# Altium schematic sheet GPS_SATA.SchDoc: RNG RPI Interface
size 420 x 297 mm; Author: G.Kasprowicz; CompanyName: WUT ISE; DrawnBy: G.Kasprowicz; Organization: WUT ISE; Address1: PW ISE; Address2: Nowowiejska 15/19 00-665 Warsaw; Address3: gkasprow@gmail.com; Revision: 2; SheetNumber: -; SheetTotal: -; ModifiedBy: -; CheckedDate: -; Title2: GPS & SATA IO; DivGrp: WUT ISE; Designer: G.Kasprowicz; ModifiedDate: -; ProjectName: Sensor Box
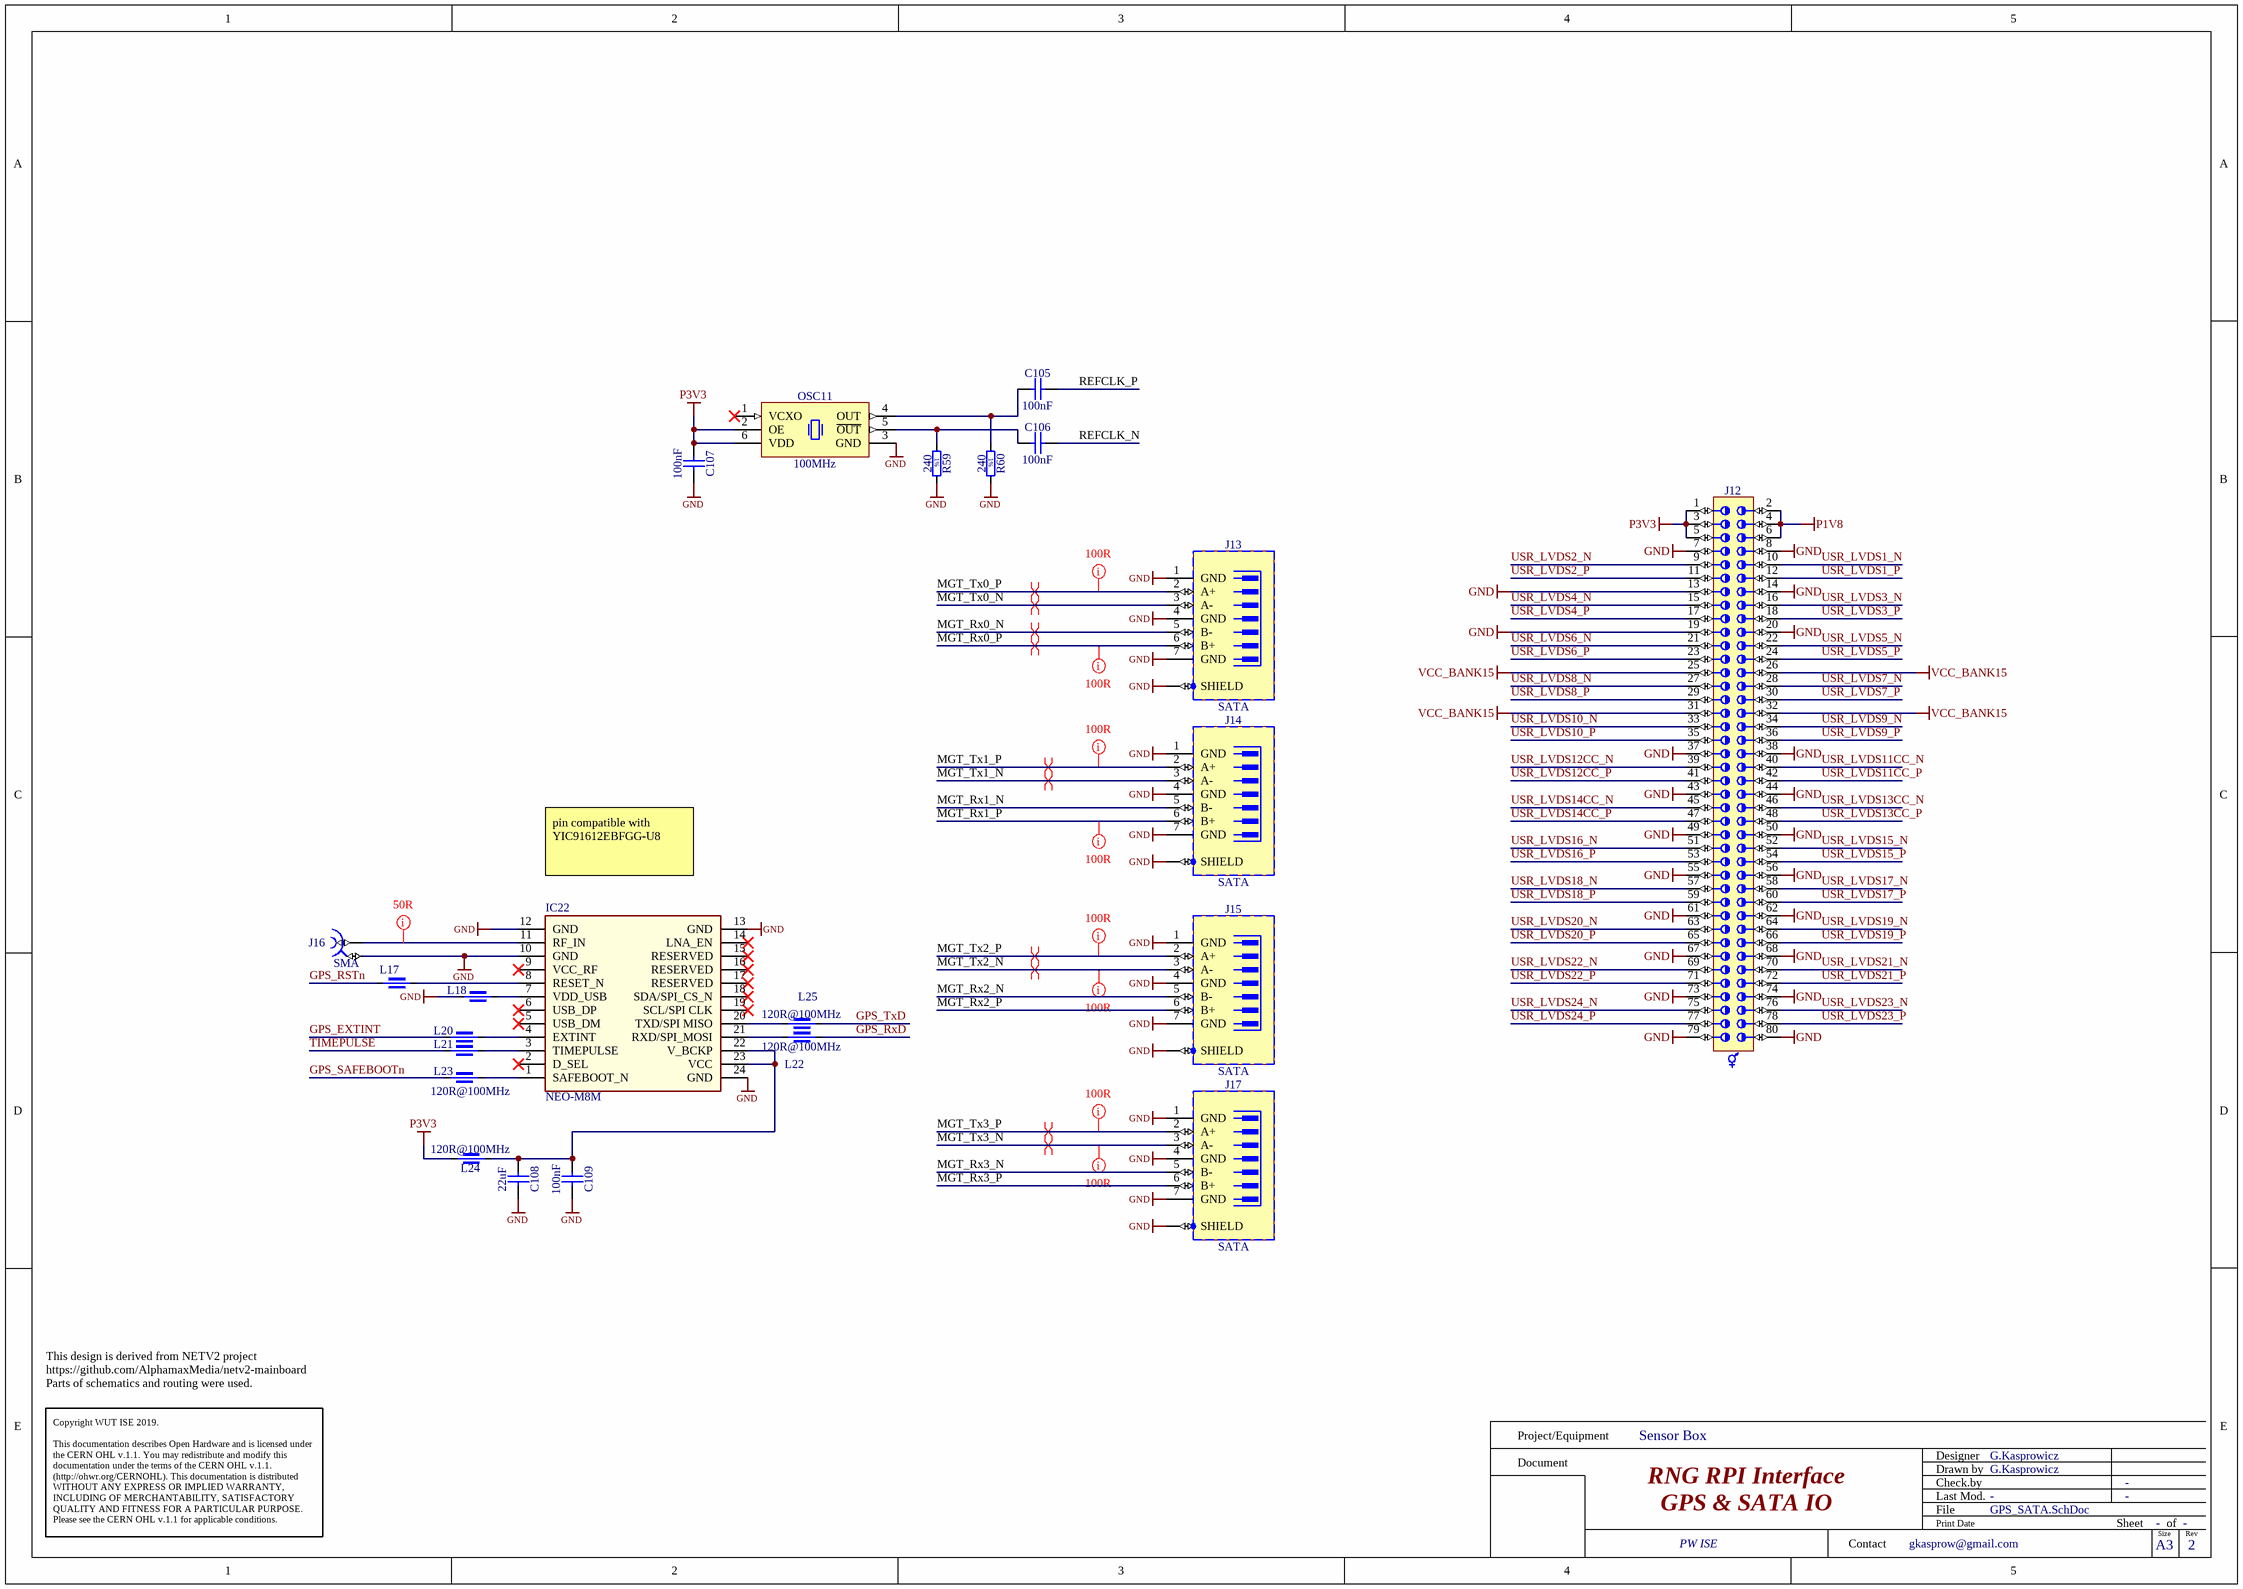
[diagram p0: GPS_SATA.SchDoc]

## Parts
C105  100nF  [CAPC0603X33N]
C106  100nF  [CAPC0603X33N]
C107  100nF  [CAPC0603X33N]
C108  22uF  [CAPC2012X135N]
C109  100nF  [CAPC0603X33N]
IC22  NEO-M8M  [NEO]
J12  (no value)  [SAMTEC_LSS-140-01-L-DV-A]
J13  SATA  [3M_5607-4200-SH]
J14  SATA  [3M_5607-4200-SH]
J15  SATA  [3M_5607-4200-SH]
J16  SMA  [MOLEX_73251-2120]
J17  SATA  [3M_5607-4200-SH]
L17  120R@100MHz  [INDC1608X65N]  (value not drawn)
L18  120R@100MHz  [INDC1608X65N]  (value not drawn)
L20  120R@100MHz  [INDC1608X65N]  (value not drawn)
L21  120R@100MHz  [INDC1608X65N]  (value not drawn)
L22  120R@100MHz  [INDC1608X65N]
L23  120R@100MHz  [INDC1608X65N]
L24  120R@100MHz  [INDC1608X65N]
L25  120R@100MHz  [INDC1608X65N]
OSC11  100MHz  [OSCSC254P500X700X190-6N]
R59  240  [RESC1005X40N]
R60  240  [RESC1005X40N]

## Nets
GND: C107.2 C108.2 C109.2 IC22.10(GND) IC22.12(GND) IC22.13(GND) IC22.24(GND) J12.7 J12.8 J12.13 J12.14 J12.19 J12.20 J12.37 J12.38 J12.43 J12.44 J12.49 J12.50 J12.55 J12.56 J12.61 J12.62 J12.67 J12.68 J12.73 J12.74 J12.79 J12.80 J13.1(GND) J13.4(GND) J13.7(GND) J13.8(SHIELD) J14.1(GND) J14.4(GND) J14.7(GND) J14.8(SHIELD) J15.1(GND) J15.4(GND) J15.7(GND) J15.8(SHIELD) J16.2 J17.1(GND) J17.4(GND) J17.7(GND) J17.8(SHIELD) L18.2 OSC11.3(GND) R59.2 R60.2
P1V8: J12.2 J12.4 J12.6
P3V3: C107.1 J12.1 J12.3 J12.5 L24.2 OSC11.2(OE) OSC11.6(VDD)
VCC_BANK15: J12.25 J12.26 J12.31 J12.32
GPS_EXTINT: L20.2
GPS_RSTn: L17.1
GPS_RxD: L22.2
GPS_SAFEBOOTn: L23.2
GPS_TxD: L25.1
MGT_Rx0_N: J13.5(B-)
MGT_Rx0_P: J13.6(B+)
MGT_Rx1_N: J14.5(B-)
MGT_Rx1_P: J14.6(B+)
MGT_Rx2_N: J15.5(B-)
MGT_Rx2_P: J15.6(B+)
MGT_Rx3_N: J17.5(B-)
MGT_Rx3_P: J17.6(B+)
MGT_Tx0_N: J13.3(A-)
MGT_Tx0_P: J13.2(A+)
MGT_Tx1_N: J14.3(A-)
MGT_Tx1_P: J14.2(A+)
MGT_Tx2_N: J15.3(A-)
MGT_Tx2_P: J15.2(A+)
MGT_Tx3_N: J17.3(A-)
MGT_Tx3_P: J17.2(A+)
REFCLK_N: C106.2
REFCLK_P: C105.2
TIMEPULSE: L21.2
USR_LVDS1_N: J12.10
USR_LVDS1_P: J12.12
USR_LVDS2_N: J12.9
USR_LVDS2_P: J12.11
USR_LVDS3_N: J12.16
USR_LVDS3_P: J12.18
USR_LVDS4_N: J12.15
USR_LVDS4_P: J12.17
USR_LVDS5_N: J12.22
USR_LVDS5_P: J12.24
USR_LVDS6_N: J12.21
USR_LVDS6_P: J12.23
USR_LVDS7_N: J12.28
USR_LVDS7_P: J12.30
USR_LVDS8_N: J12.27
USR_LVDS8_P: J12.29
USR_LVDS9_N: J12.34
USR_LVDS9_P: J12.36
USR_LVDS10_N: J12.33
USR_LVDS10_P: J12.35
USR_LVDS11CC_N: J12.40
USR_LVDS11CC_P: J12.42
USR_LVDS12CC_N: J12.39
USR_LVDS12CC_P: J12.41
USR_LVDS13CC_N: J12.46
USR_LVDS13CC_P: J12.48
USR_LVDS14CC_N: J12.45
USR_LVDS14CC_P: J12.47
USR_LVDS15_N: J12.52
USR_LVDS15_P: J12.54
USR_LVDS16_N: J12.51
USR_LVDS16_P: J12.53
USR_LVDS17_N: J12.58
USR_LVDS17_P: J12.60
USR_LVDS18_N: J12.57
USR_LVDS18_P: J12.59
USR_LVDS19_N: J12.64
USR_LVDS19_P: J12.66
USR_LVDS20_N: J12.63
USR_LVDS20_P: J12.65
USR_LVDS21_N: J12.70
USR_LVDS21_P: J12.72
USR_LVDS22_N: J12.69
USR_LVDS22_P: J12.71
USR_LVDS23_N: J12.76
USR_LVDS23_P: J12.78
USR_LVDS24_N: J12.75
USR_LVDS24_P: J12.77
NetC105_1: C105.1 OSC11.4(OUT) R60.1
NetC106_1: C106.1 OSC11.5(~{OUT}) R59.1
NetC108_1: C108.1 C109.1 IC22.22(V_BCKP) IC22.23(VCC) L24.1
NetIC22_1: IC22.1(SAFEBOOT_N) L23.1
NetIC22_3: IC22.3(TIMEPULSE) L21.1
NetIC22_4: IC22.4(EXTINT) L20.1
NetIC22_7: IC22.7(VDD_USB) L18.1
NetIC22_8: IC22.8(RESET_N) L17.2
NetIC22_11: IC22.11(RF_IN) J16.1
NetIC22_20: IC22.20(TXD/SPI_MISO) L25.2
NetIC22_21: IC22.21(RXD/SPI_MOSI) L22.1

Not connected (* = marked no-connect by the designer): IC22 2(D_SEL)* 5(USB_DM)* 6(USB_DP)* 9(VCC_RF)* 14(LNA_EN)* 15(RESERVED)* 16(RESERVED)* 17(RESERVED)* 18(SDA/SPI_CS_N)* 19(SCL/SPI_CLK)*; OSC11 1(VCXO)*

## Layout directives
differential pair: MGT_Rx0_N, MGT_Rx0_P, MGT_Tx0_N, MGT_Tx0_P, MGT_Tx1_N, MGT_Tx1_P, MGT_Tx2_N, MGT_Tx2_P, MGT_Tx3_N, MGT_Tx3_P
net class Z100R: MGT_Rx0_P, MGT_Rx1_P, MGT_Tx0_P, MGT_Tx1_P, MGT_Tx2_N, MGT_Tx2_P, MGT_Tx3_N, MGT_Tx3_P
net class Z50R: NetIC22_11

## Notes on the sheet
- pin compatible with YIC91612EBFGG-U8
- This design is derived from NETV2 project
  https://github.com/AlphamaxMedia/netv2-mainboard
  Parts of schematics and routing were used.
- Project/Equipment
- Document
- Designer
- Drawn by
- Check.by
- Copyright WUT ISE 2019.
  This documentation describes Open Hardware and is licensed under the CERN OHL v.1.1. You may redistribute and modify this documentation under the terms of the CERN OHL v.1.1. (http://ohwr.org/CERNOHL). This documentation is distributed WITHOUT ANY EXPRESS OR IMPLIED WARRANTY, INCLUDING OF MERCHANTABILITY, SATISFACTORY QUALITY AND FITNESS FOR A PARTICULAR PURPOSE. Please see the CERN OHL v.1.1 for applicable conditions.
- Contact
- File
- Last Mod.
- Print Date
- Sheet
- Size
- A3
- of
- Rev
- (in symbol R0402_240R_1%_0.0625W_100PPM) 1%

## Library data of the parts
C105-C107 C109 = CC0201_100NF_6.3V_10%_X5R: Non-polarised capacitor; Part Description: SMD Multilayer Chip Ceramic Capacitor; Manufacturer: GENERIC; Manufacturer1 Part Number: 02016D104KAT2A; Voltage: 6.3V; TC: X5R; Tolerance: ±10%; Part Number: CC0201_100NF_6.3V_10%_X5R; Component Kind: Standard; Component Type: Standard; Pin Count: 2; Value: 100nF; Status: Not Recommended; Manufacturer Part Number: CC0201_100NF_6.3V_10%_X5R; Case: 0201; Mounted: Yes; Socket: No; SMD: Yes; Sense: No; Manufacturer1 Example: AVX; Manufacturer1 ComponentHeight: 0.33mm; HelpURL: \\cern.ch\dfs\Applications\Altium\Datasheets\CC0201_X5R_AVX.pdf; Author: CERN DEM JLC; CreateDate: 03.12.2007; LatestRevisionDate: 03.12.2007
C108 = CC0805_22UF_16V_10%_X5R: Non-polarised capacitor; Part Description: SMD Multilayer Chip Ceramic Capacitor; Manufacturer: GENERIC; Manufacturer1 Part Number: C2012X5R1C226KT; Voltage: 16V; TC: X5R; Tolerance: ±10%; LatestRevisionDate: 25.10.2012; Value: 22uF; Part Number: CC0805_22UF_16V_10%_X5R; Component Kind: Standard; Component Type: Standard; Pin Count: 2; Status: Preferred; Manufacturer Part Number: CC0805_22UF_16V_10%_X5R; Case: 0805; Mounted: Yes; Socket: No; SMD: Yes; Sense: No; Manufacturer1 Example: TDK; Manufacturer1 ComponentHeight: 1.35mm; HelpURL: \\cern.ch\dfs\Applications\Altium\Datasheets\CC0805_X5R_TDK_C.pdf; Author: CERN DEM JLC; CreateDate: 25.10.2012
IC22 = NEO: u-blox NEO GNSS module; Part Description: u-blox GNSS module; Manufacturer: u-blox; Value: NEO-M8M
J12 = SAMTEC_LSS-140-01-L-DV-A: Connector 80 Hermaphroditic; Part Description: 80 Contacts, Pitch 0.635mm, Razor Beam LSS Vertical High Speed Hermaphroditic Strip (Lead Style 4.5mm); Manufacturer: SAMTEC; PressFit: No; Part Number: SAMTEC_LSS-140-01-L-DV-A; Component Kind: Standard; Component Type: Standard; Pin Count: 80; Mounted: Yes; Socket: No; Sense: No; SMD: Yes; Status: None; Manufacturer Part Number: LSS-140-01-L-DV-A; ComponentHeight: 4.57mm; HelpURL: \\cern.ch\dfs\Applications\Altium\Datasheets\SAMTEC_LSS-140-01-L-DV-A.pdf; Author: CERN DEM JMW; CreateDate: 10.11.2015; LatestRevisionDate: 10.11.2015
J13-J15 J17 = 3M_5607-4200-SH: 7 Pin + 1 Shield SATA Receptacle; Part Description: Signal Plug, Surfacemount, Right Angle,  Serial Advanced Technology Attachment (SATA) Connector, 5607 Series; Manufacturer: 3M; PressFit: No; Part Number: 3M_5607-4200-SH; Component Kind: Standard; Component Type: Standard; Pin Count: 8; Family: SATA; Mounted: Yes; Socket: No; SMD: Yes; Sense: No; Status: None; Manufacturer Part Number: 5607-4200-SH; ComponentHeight: 4mm; HelpURL: \\cern.ch\dfs\Applications\Altium\Datasheets\3M_5607-4200-SH.pdf; Author: CERN DEM JLC; CreateDate: 14.02.2011; LatestRevisionDate: 31.05.2011
J16 = CON_SMA_RA_SMD_73251-2120: 50 Ohm, SMA Edge Mount PCB, With Jam Nut And Lock Washer; Manufacturer: MOLEX; PressFit: No; Part Number: MOLEX_73251-2120; Component Kind: Standard; Component Type: Standard; Pin Count: 5; Family: SMA; Mounted: Yes; Socket: No; SMD: Yes; Sense: No; Status: None; Part Description: 50 Ohm, SMA Edge Mount PCB, With Jam Nut And Lock Washer; Manufacturer Part Number: 73251-2120; ComponentHeight: 5.75mm; HelpURL: \\cern.ch\dfs\Applications\Altium\Datasheets\MOLEX_73251-2121.pdf; Author: CERN DEM JLC; CreateDate: 26.10.2016; LatestRevisionDate: 26.10.2016
L17 L18 L20-L25 = IND0603_MURATA_BLM18SG121TN1D: Part Description: SMD EMIFIL Suppression Chip Ferrite Bead; Manufacturer: MURATA; Power: 3A; Resistance: 0.025R; Tolerance: ±25%; LatestRevisionDate: 25.10.2018; Value: 120R@100MHz; Part Number: IND0603_MURATA_BLM18SG121TN1D; Component Kind: Standard; Component Type: Standard; Pin Count: 2; Status: None; Manufacturer Part Number: BLM18SG121TN1D; Case: 0603; Mounted: Yes; Socket: No; SMD: Yes; Sense: No; ComponentHeight: 0.65mm; HelpURL: \\cern.ch\dfs\Applications\Altium\Datasheets\IND0603_MURATA_BLM18S.pdf; Author: CERN DEM JLC; CreateDate: 23.07.2014
OSC11 = OSC_100MHz_LVPECL: VCXO 100MHz Oscillator; Part Number: OSC_100MHZ_ABRACON_ASG-P-V-A-100.000MHZ; Part Description: Stability: ± 50ppm, -40°C to +85°C, Programmable - High Performance SMD XO, LVPECL Output, ASG-P Series; Manufacturer: ABRACON; Manufacturer Part Number: ASG-P-V-A-100.000MHZ; PressFit: No; Bonding: No; Component Kind: Standard; Component Type: Standard; PackageDescription: Oscillator, side concave; 2.54mm pitch; 6 pin, 5.00mm L X 7.00mm W X 1.90mm H, IPC Medium Density; Value: 100MHz; Pin Count: 6; Mounted: Yes; Socket: No; SMD: Yes; Sense: No; ComponentHeight: 1.9mm; HelpURL: \\cern.ch\dfs\Applications\Altium\Datasheets\OSC_ABRACON_ASG-D.pdf; Author: GK; CreateDate: 20.04.2016; LatestRevisionDate: 20.04.2016
R59 R60 = R0402_240R_1%_0.0625W_100PPM: Resistor - 1%; Part Description: General Purpose Thick Film Chip Resistor; Manufacturer: GENERIC; Manufacturer1 Part Number: 232270672401L; TC: ±100ppm/°C; PressFit: No; Part Number: R0402_240R_1%_0.0625W_100PPM; Component Kind: Standard; Component Type: Standard; Pin Count: 2; Value: 240; Status: Not Recommended; Power: 0.0625W; Tolerance: ±1%; Manufacturer Part Number: R0402_240R_1%_0.0625W_100PPM; Case: 0402; Mounted: Yes; Sense: No; Socket: No; SMD: Yes; Manufacturer1 Example: YAGEO PHYCOMP; Manufacturer1 ComponentHeight: 0.4mm; HelpURL: \\cern.ch\dfs\Applications\Altium\Datasheets\R0402_Phycomp_RC0402.pdf; Author: CERN DEM JLC; CreateDate: 03.12.2007; LatestRevisionDate: 17.10.2012